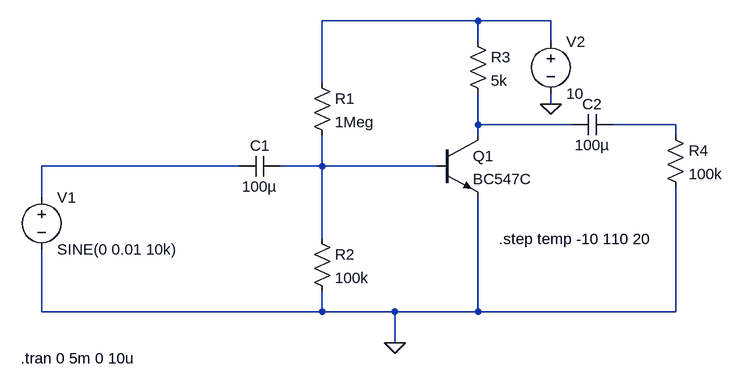
[diagram p0: schematic BJT_Temperature_Amplifier.asc]
BJT_Temperature_Amplifier.asc, the LTspice schematic file:
Version 4.1
SHEET 1 880 680
WIRE 272 -64 32 -64
WIRE 384 -64 272 -64
WIRE 272 -32 272 -64
WIRE 384 -32 384 -64
WIRE 32 32 32 -64
WIRE 384 64 384 48
WIRE 272 96 272 48
WIRE 416 96 272 96
WIRE 576 96 480 96
WIRE 272 112 272 96
WIRE 576 112 576 96
WIRE -96 160 -400 160
WIRE 32 160 32 112
WIRE 32 160 -32 160
WIRE 208 160 32 160
WIRE -400 208 -400 160
WIRE 32 272 32 160
WIRE -400 384 -400 288
WIRE 32 384 32 352
WIRE 32 384 -400 384
WIRE 144 384 32 384
WIRE 272 384 272 208
WIRE 272 384 144 384
WIRE 576 384 576 192
WIRE 576 384 272 384
WIRE 144 432 144 384
FLAG 384 64 0
FLAG 144 432 0
SYMBOL npn 208 112 R0
SYMATTR InstName Q1
SYMATTR Value BC547C
SYMBOL res 16 16 R0
SYMATTR InstName R1
SYMATTR Value 1Meg
SYMBOL res 16 256 R0
SYMATTR InstName R2
SYMATTR Value 100k
SYMBOL res 256 -48 R0
SYMATTR InstName R3
SYMATTR Value 5k
SYMBOL res 560 96 R0
SYMATTR InstName R4
SYMATTR Value 100k
SYMBOL cap 480 80 R90
WINDOW 0 0 32 VBottom 2
WINDOW 3 32 32 VTop 2
SYMATTR InstName C2
SYMATTR Value 100µ
SYMBOL voltage 384 -48 R0
WINDOW 123 0 0 Left 0
WINDOW 39 0 0 Left 0
SYMATTR InstName V2
SYMATTR Value 10
SYMBOL cap -32 144 R90
WINDOW 0 0 32 VBottom 2
WINDOW 3 32 32 VTop 2
SYMATTR InstName C1
SYMATTR Value 100µ
SYMBOL voltage -400 192 R0
WINDOW 123 0 0 Left 0
WINDOW 39 0 0 Left 0
SYMATTR InstName V1
SYMATTR Value SINE(0 0.01 10k)
TEXT 304 272 Left 2 !.step temp -10 110 20
TEXT -432 456 Left 2 !.tran 0 5m 0 10u

The netlist it stands for:
* BJT_Temperature_Amplifier.asc
Q1 N002 N005 0 0 BC547C
R1 N001 N005 1Meg
R2 N005 0 100k
R3 N001 N002 5k
R4 N003 0 100k
C2 N003 N002 100µ
V2 N001 0 10
C1 N005 N004 100µ
V1 N004 0 SINE(0 0.01 10k)
.model NPN NPN
.model PNP PNP
.lib standard.bjt
.step temp -10 110 20
.tran 0 5m 0 10u
.backanno
.end